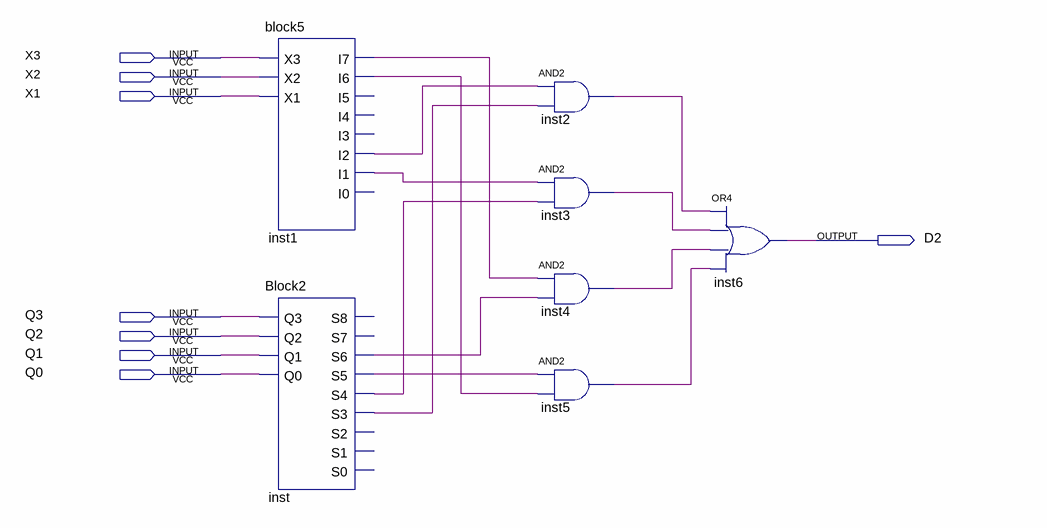
[diagram p0: schematic sheet]
// Quartus schematic block7.bdf as structural Verilog: 7 symbols, 8 pins
module block7 (
  input  X3,
  input  X2,
  input  X1,
  input  Q3,
  input  Q2,
  input  Q1,
  input  Q0,
  output D2
);

  wire inst1_i1, inst1_i2, inst1_i6, inst1_i7, inst2_out, inst3_out, inst4_out, inst5_out, inst_s3, inst_s4,
       inst_s5, inst_s6;

  block5 inst1 (
    .X3(X3), .X2(X2), .X1(X1), .I7(inst1_i7), .I6(inst1_i6), .I2(inst1_i2), .I1(inst1_i1));  // open: I5, I4, I3, I0
  Block2 inst (
    .Q3(Q3), .Q2(Q2), .Q1(Q1), .Q0(Q0), .S6(inst_s6), .S5(inst_s5), .S4(inst_s4), .S3(inst_s3));  // open: S8, S7, S2, S1, S0
  and inst2 (inst2_out, inst1_i2, inst_s3);
  and inst3 (inst3_out, inst1_i1, inst_s4);
  and inst4 (inst4_out, inst1_i7, inst_s6);
  and inst5 (inst5_out, inst_s5, inst1_i6);
  or inst6 (D2, inst2_out, inst3_out, inst4_out, inst5_out);
endmodule
